# Altium schematic sheet DACN_shematic.SchDoc
size A
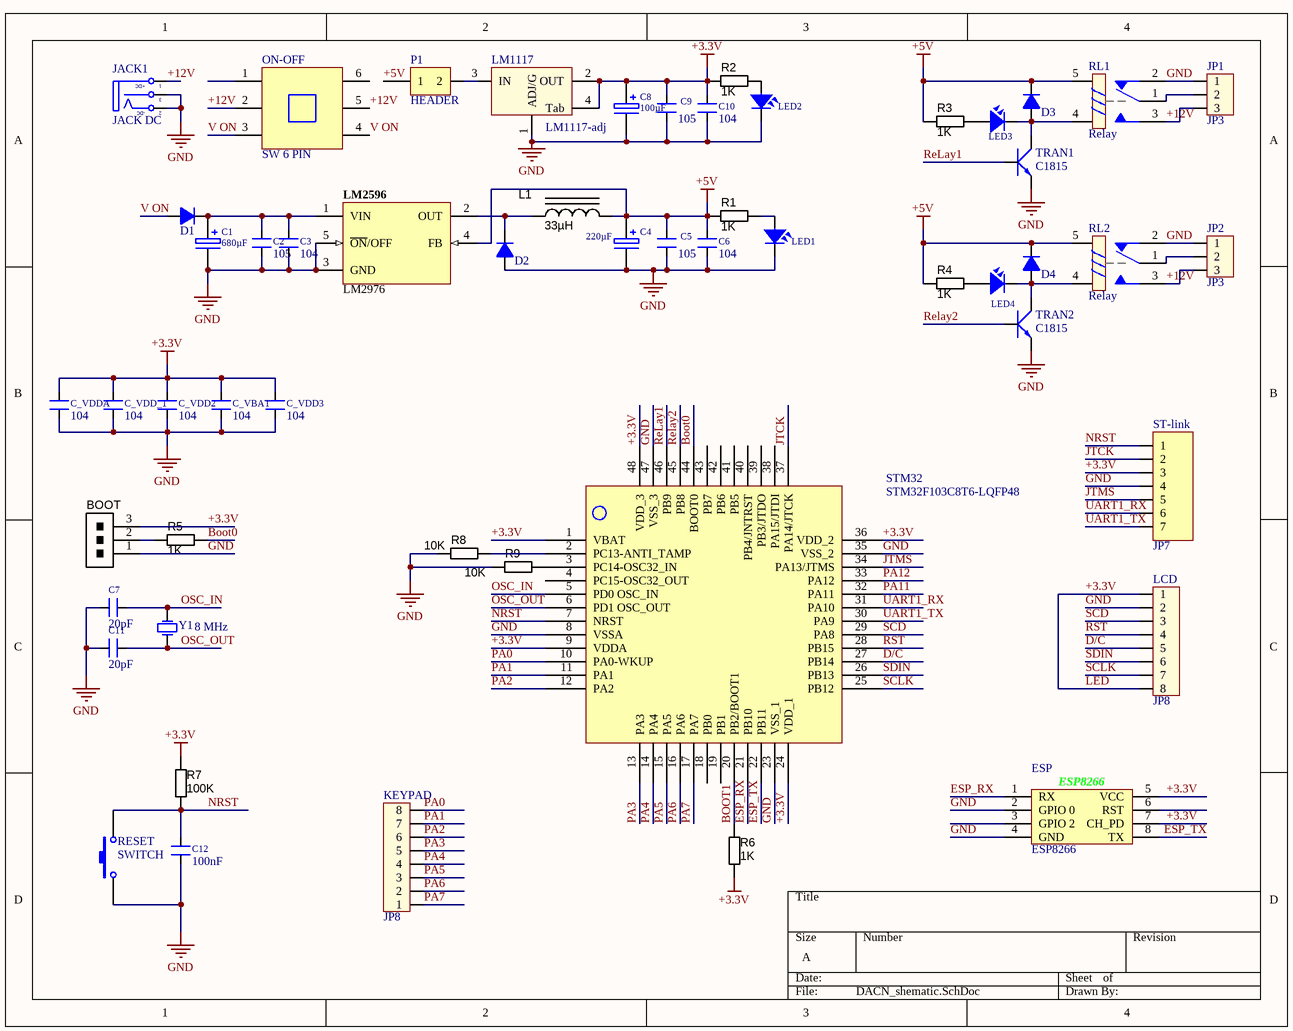
[diagram p0: DACN_shematic.SchDoc]

## Parts
BOOT  CONN_HEADER_1x3P_0.100in  [1x3POS_HEADER]  (value not drawn)
C1  10µF  [CAP_ELEC_5x5.7]  (value not drawn)
C2  105  [SM-CAP-0805]
C3  104  [SM-CAP-0805]
C4  10µF  [CAP_ELEC_5x5.7]  (value not drawn)
C5  105  [SM-CAP-0805]
C6  104  [SM-CAP-0805]
C7  20pF  [SM-CAP-0805]
C8  10µF  [CAP_ELEC_5x5.7]  (value not drawn)
C9  105  [SM-CAP-0805]
C10  104  [SM-CAP-0805]
C11  20pF  [SM-CAP-0805]
C12  100nF  [SM-CAP-0805]
C_VBAT  104  [SM-CAP-0805]
C_VDD2  104  [SM-CAP-0805]
C_VDD3  104  [SM-CAP-0805]
C_VDD_1  104  [SM-CAP-0805]
C_VDDA  104  [SM-CAP-0805]
D1  Diode  1N4007  [DO-214AC]  (value not drawn)
D2  Diode  1N4007  [DO-214AC]  (value not drawn)
D3  Diode  1N4007  [DO-214AC]  (value not drawn)
D4  Diode  1N4007  [DO-214AC]  (value not drawn)
ESP  ESP8266  [ESP2866]
JACK1  JACK DC  [JACK DC]
JP1  JP3  [CON3]
JP2  JP3  [CON3]
KEYPAD  JP8  [jam8]
L1  33µH  [IND_WW_DR73]
LCD  JP8  [jam8]
LED1  LED SMD  [SM-LED-0805-Blue]  (value not drawn)
LED2  LED SMD  [SM-LED-0805-Blue]  (value not drawn)
LED3  LED SMD  [SM-LED-0805-Blue]  (value not drawn)
LED4  LED SMD  [SM-LED-0805-Blue]  (value not drawn)
LM1117  LM1117-adj  [SOT223-4N]
LM2596  LM2976  [TO263]
ON-OFF  SW 6 PIN  [SW6]
P1  HEADER  [JUMPER PITCH 2 PIN]
R1  value 1K  [RESC2012N_ZERO]  (hidden comment: Jumper)
R2  value 1K  [RESC2012N_ZERO]  (hidden comment: Jumper)
R3  value 1K  [RESC2012N_ZERO]  (hidden comment: Jumper)
R4  value 1K  [RESC2012N_ZERO]  (hidden comment: Jumper)
R5  value 1K  [RESC2012N_ZERO]  (hidden comment: Jumper)
R6  value 1K  [RESC2012N_ZERO]  (hidden comment: Jumper)
R7  value 100K  [RESC2012N_ZERO]  (hidden comment: Jumper)
R8  value 10K  [RESC2012N_ZERO]  (hidden comment: Jumper)
R9  value 10K  [RESC2012N_ZERO]  (hidden comment: Jumper)
RESET  SWITCH  [SW 4PIN]
RL1  Relay  [RL_SPDT_10A]
RL2  Relay  [RL_SPDT_10A]
ST-link  JP7  [JP7-D1T]
STM32  STM32F103C8T6-LQFP48  [LQFP 48 PIN]
TRAN1  C1815  [C1815]
TRAN2  C1815  [C1815]
Y1  8 MHz  [CRYSTAL DIP]

## Nets
+3.3V: BOOT.3 C8.1 C9.2 C10.2 C_VBAT.2 C_VDD2.2 C_VDD3.2 C_VDD_1.2 C_VDDA.2 ESP.5(VCC) ESP.7(CH_PD) LCD.1 LCD.8 LM1117.2(OUT) LM1117.4(Tab) R2.1 R6.1 R7.2 ST-link.3 STM32.1(VBAT) STM32.9(VDDA) STM32.24(VDD_1) STM32.36(VDD_2) STM32.48(VDD_3)  [also labelled LED]
+5V: C4.1 C5.2 C6.2 D3.K D4.K L1.2 LM2596.4(FB) P1.1 R1.1 R3.1 R4.1 RL1.5 RL2.5
GND: BOOT.1 C1.2 C2.1 C3.1 C4.2 C5.1 C6.1 C7.2 C8.2 C9.1 C10.1 C11.2 C12.2 C_VBAT.1 C_VDD2.1 C_VDD3.1 C_VDD_1.1 C_VDDA.1 D2.A ESP.2(GPIO_0) ESP.4(GND) JACK1.2(TN) JACK1.3(S) JP1.1 JP2.1 LCD.2 LED1.2 LED2.2 LM1117.1(ADJ/G) LM2596.3(GND) LM2596.5(~{ON}/OFF) R8.2 R9.2 RESET.1 RL1.2 RL2.2 ST-link.4 STM32.8(VSSA) STM32.23(VSS_1) STM32.35(VSS_2) STM32.47(VSS_3) TRAN1.2(E) TRAN2.2(E)
+12V: JACK1.1(T) JP1.3 JP2.3 ON-OFF.2 ON-OFF.5 RL1.3 RL2.3
Boot0: R5.2 STM32.44(BOOT0)
BOOT1: R6.2 STM32.20(PB2/BOOT1)
D/C: LCD.5 STM32.27(PB14)
ESP_RX: ESP.1(RX) STM32.21(PB10)
ESP_TX: ESP.8(TX) STM32.22(PB11)
JTCK: ST-link.2 STM32.37(PA14/JTCK)
JTMS: ST-link.5 STM32.34(PA13/JTMS)
NRST: C12.1 R7.1 RESET.2 ST-link.1 STM32.7(NRST)
OSC_IN: C7.1 STM32.5(PD0_OSC_IN) Y1.2(OSC2)
OSC_OUT: C11.1 STM32.6(PD1_OSC_OUT) Y1.1(OSC1)
PA0: KEYPAD.8 STM32.10(PA0-WKUP)
PA1: KEYPAD.7 STM32.11(PA1)
PA2: KEYPAD.6 STM32.12(PA2)
PA3: KEYPAD.5 STM32.13(PA3)
PA4: KEYPAD.4 STM32.14(PA4)
PA5: KEYPAD.3 STM32.15(PA5)
PA6: KEYPAD.2 STM32.16(PA6)
PA7: KEYPAD.1 STM32.17(PA7)
PA11: STM32.32(PA11)
PA12: STM32.33(PA12)
ReLay1: STM32.46(PB9) TRAN1.1(B)
Relay2: STM32.45(PB8) TRAN2.1(B)
RST: LCD.4 STM32.28(PB15)
SCD: LCD.3 STM32.29(PA8)
SCLK: LCD.7 STM32.25(PB12)
SDIN: LCD.6 STM32.26(PB13)
UART1_RX: ST-link.6 STM32.31(PA10)
UART1_TX: ST-link.7 STM32.30(PA9)
V ON: D1.A ON-OFF.3 ON-OFF.4
NetBOOT_2: BOOT.2 R5.1
NetC1_1: C1.1 C2.2 C3.2 D1.K LM2596.1(VIN)
NetD2_K: D2.K L1.1 LM2596.2(OUT)
NetD3_A: D3.A LED3.2 RL1.4 TRAN1.3(C)
NetD4_A: D4.A LED4.2 RL2.4 TRAN2.3(C)
NetJP1_2: JP1.2 RL1.1
NetJP2_2: JP2.2 RL2.1
NetLED1_1: LED1.1 R1.2
NetLED2_1: LED2.1 R2.2
NetLED3_1: LED3.1 R3.2
NetLED4_1: LED4.1 R4.2
NetLM1117_3: LM1117.3(IN) P1.2
NetR8_1: R8.1 STM32.2(PC13-ANTI_TAMP)
NetR9_1: R9.1 STM32.3(PC14-OSC32_IN)

Not connected (* = marked no-connect by the designer): ESP 3(GPIO_2) 6(RST); ON-OFF 1 6; STM32 4(PC15-OSC32_OUT) 18(PB0) 19(PB1) 38(PA15/JTDI) 39(PB3/JTDO) 40(PB4/JNTRST) 41(PB5) 42(PB6) 43(PB7)

## Notes on the sheet
- (in symbol CAP Aluminum) 680µF; 100µF; 220µF
- (in symbol JACK DC) +DC; -DC

## Library data of the parts
BOOT = CONN_HEADER_1x3P_0.100in: Pin Header, THT, Single-row, 2.54mm pitch; Manufacturer 1: 3M; Manufacturer Part Number 1: 929647-09-36-I; Pitch: 0.100" (2.54mm); Value: Single-row, 3 positions; QtyOverride: 0.1; SCDType: undef; Category: Connectors; Mounting Type: Through Hole; Terminal Block Type: Header, Male Pins, Single; Package / Case: Pin header; 2.54mm pitch
C1 C4 C8 = CAP Aluminum
C2 C3 C5-C7 C9-C12 C_VBAT C_VDD2 C_VDD3 C_VDD_1 C_VDDA = CAP SMD: Value: 0,1uF/300V; Designed by: VanDungEvn
D1-D4 = Diode  1N4007: Diode 1A; Value: 1N4007
JACK1 = JACK DC: Value: Jac DC
JP1 JP2 = Con3: Connector 3; Value: Connector 3
KEYPAD LCD = jam 8: Value: Connector 8
L1 = INDC_10u_DR73-100-R: Inductor Power 10µH 2.1A 7.6x7.6mm SMD; Manufacturer 1: Cooper Bussmann; Tolerance: ±20%; Material: ferrite shielded; SCDType: spec; Package / Case: 5.0x5.0x4.5mm; Ratings: 2.1 A; Supplier 1: Digi-Key; Supplier Part Number 1: 513-1129-1-ND; Manufacturer Part Number 1: DR73-100-R; ComponentLink1URL: http://www.cooperindustries.com/content/dam/public/bussmann/Electronics/Resources/Data%20Sheets/Bus_Elx_DS_4315_DR_Series.pdf; ComponentLink1Description: http://www.cooperindustries.com/content/dam/public/bussmann/Electronics/Resources/Data%20Sheets/Bus_Elx_DS_4315_DR_Series.pdf; Value: 33µH
LED1-LED4 = LED SMD 0805
LM1117 = LM1117-adj: 3v3; Value: LM317
LM2596 = LM2596: Max Input Voltage: 12 V; Max Output Current: 3 (6.0 peak) A; Max Output Voltage: mV; Category: IC-Power; Min Input Voltage: mV; Min Output Voltage: mV; Mounting Technology: Surface Mount; Status: Unreleased; Supply Voltage: mV; Temperature Range: -40 to +125 degC
P1 = HEADER CONNECT
R1-R9 = RES_0805: Resistor SMD chip 0.0 Ohm 0.125W 0805; Manufacturer 1: Samsung Electro-Mechanics America, Inc; Manufacturer Part Number 1: RC2012J000CS; Ratings: 1/8W; SCDType: spec; Tolerance: N/A; Package / Case: 0805 (2012 metric); Supplier 1: Digi-Key; Supplier Part Number 1: 1276-5466-6-ND; RoHS 1: RoHS Compliant; ComponentLink1URL: http://www.samsungsem.com/servlet/FileDownload?filename=productcatalog/pdf/Chip_Resistor.pdf; ComponentLink1Description: http://www.samsungsem.com/servlet/FileDownload?filename=productcatalog/pdf/Chip_Resistor.pdf; Supplier 2: Digi-Key; Supplier Part Number 2: RMCF0805ZT0R00DKR-ND; Manufacturer 2: Stackpole Electronics Inc; Manufacturer Part Number 2: RMCF0805ZT0R00; RoHS 2: RoHS Compliant; ComponentLink2URL: http://www.seielect.com/Catalog/SEI-RMCF_RMCP.pdf; ComponentLink2Description: http://www.seielect.com/Catalog/SEI-RMCF_RMCP.pdf; Supplier 3: Digi-Key; Supplier Part Number 3: 311-0.0ARDKR-ND; Manufacturer 3: Yageo; Manufacturer Part Number 3: RC0805JR-070RL; RoHS 3: RoHS Compliant; ComponentLink3URL: http://media.digikey.com/pdf/Data%20Sheets/Yageo%20PDFs/RC0805%20Pb%20Free.pdf; ComponentLink3Description: http://media.digikey.com/pdf/Data%20Sheets/Yageo%20PDFs/RC0805%20Pb%20Free.pdf; Supplier 4: Digi-Key; Supplier Part Number 4: P0.0ADKR-ND; Manufacturer 4: Panasonic Electronic Components; Manufacturer Part Number 4: ERJ-6GEY0R00V; RoHS 4: RoHS Compliant; ComponentLink4URL: http://industrial.panasonic.com/www-cgi/jvcr13pz.cgi?E+PZ+3+AOA0001+ERJ6GEY0R00V+7+WW; ComponentLink4Description: http://industrial.panasonic.com/www-cgi/jvcr13pz.cgi?E+PZ+3+AOA0001+ERJ6GEY0R00V+7+WW; Supplier 5: Digi-Key; Supplier Part Number 5: RHM0.0CPDKR-ND; Manufacturer 5: Rohm Semiconductor; Manufacturer Part Number 5: MCR10ERTJ000; RoHS 5: RoHS Compliant; ComponentLink5URL: http://rohmfs.rohm.com/en/products/databook/datasheet/passive/resistor/chip_resistor/mcr_g.pdf; ComponentLink5Description: http://rohmfs.rohm.com/en/products/databook/datasheet/passive/resistor/chip_resistor/mcr_g.pdf
RL1 RL2 = Relay SRD: Relay SPDT 5 Pin; Value: Relay SPDT, 10A, 12V
ST-link = JP7: WR-PHD 2.54 mm Angled Socket Header; Manufacturer: W¨¹rth Elektronik eiSos GmbH; partNo: 613007143121; ComponentLink1 Description: Manufacturer; ComponentLink2 Description: Datasheet; NoPins: 07; Created Date: 29 March 2013; ComponentLink1URL: http://www.we-online.com; ComponentLink2URL: http://katalog.we-online.de/em/datasheet/6130xx143121.pdf; Created by: Karrer Zheng
TRAN1 TRAN2 = C1815: NPN 600mW, ECB; Value: C1815
Y1 = Crystal: Published: 8-Jun-2000; LatestRevisionDate: 17-Jul-2002; LatestRevisionNote: Re-released for DXP Platform.; PackageReference: R38; Publisher: Altium Limited
RESET = SWITCH: Published: 24-Mar-1999; LatestRevisionDate: 17-Jul-2002; LatestRevisionNote: Re-released for DXP Platform.; PackageReference: SPST-2; Publisher: Altium Limited
STM32 = STM32F103C8T6-LQFP48: Published: 30-May-2008; DatasheetVersion: rev6, Mar-2008; PackageVersion: Mar-2008; PackageReference: LQFP48; Publisher: Altium Limited; PackageDescription: 48-Pin Low-Profile Quad Flat Pack, 7 x 7 mm Body, 0.5 mm Pitch (LQFP48); ComponentLink1Description: Manufacturer Link; ComponentLink1URL: www.st.com/stm32; ComponentLink2Description: Datasheet; ComponentLink2URL: http://www.st.com/stonline/products/literature/ds/13586.pdf